# Altium project PCB_Project_cubic.PrjPcb
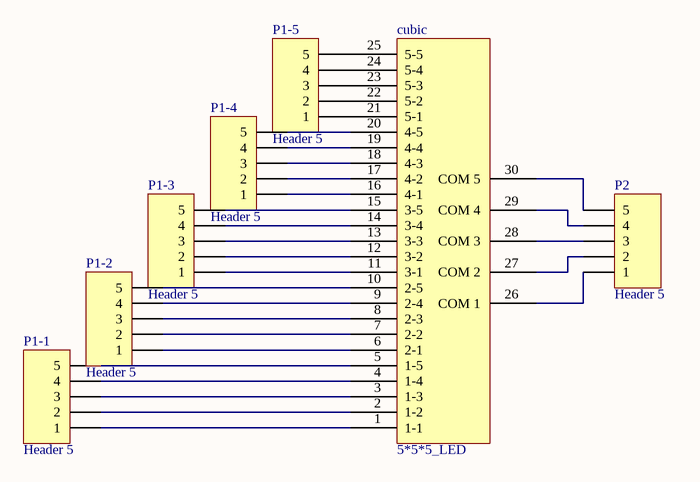
[diagram p0: BJT.SchDoc]
1 sheet, 7 parts. Net scope: global (net labels, ports and power ports of the same name join across sheets).
Board file: PCB1.PcbDoc

## Sheet BJT.SchDoc
size A4; SheetNumber: 1; SheetTotal: 1; SPICEModelCacheCIMVWHFW: <root> / <DocumentId>CIMVWHFW</DocumentId> / </root>

### Parts
cubic  5*5*5_LED  [PCBComponent_1]
P1-1  Header 5  [HDR1X5]
P1-2  Header 5  [HDR1X5]
P1-3  Header 5  [HDR1X5]
P1-4  Header 5  [HDR1X5]
P1-5  Header 5  [HDR1X5]
P2  Header 5  [HDR1X5]

### Nets
Netcubic_1: cubic.1(1-1) P1-1.1
Netcubic_2: cubic.2(1-2) P1-1.2
Netcubic_3: cubic.3(1-3) P1-1.3
Netcubic_4: cubic.4(1-4) P1-1.4
Netcubic_5: cubic.5(1-5) P1-1.5
Netcubic_6: cubic.6(2-1) P1-2.1
Netcubic_7: cubic.7(2-2) P1-2.2
Netcubic_8: cubic.8(2-3) P1-2.3
Netcubic_9: cubic.9(2-4) P1-2.4
Netcubic_10: cubic.10(2-5) P1-2.5
Netcubic_11: cubic.11(3-1) P1-3.1
Netcubic_12: cubic.12(3-2) P1-3.2
Netcubic_13: cubic.13(3-3) P1-3.3
Netcubic_14: cubic.14(3-4) P1-3.4
Netcubic_15: cubic.15(3-5) P1-3.5
Netcubic_16: cubic.16(4-1) P1-4.1
Netcubic_17: cubic.17(4-2) P1-4.2
Netcubic_18: cubic.18(4-3) P1-4.3
Netcubic_19: cubic.19(4-4) P1-4.4
Netcubic_20: cubic.20(4-5) P1-4.5
Netcubic_21: cubic.21(5-1) P1-5.1
Netcubic_22: cubic.22(5-2) P1-5.2
Netcubic_23: cubic.23(5-3) P1-5.3
Netcubic_24: cubic.24(5-4) P1-5.4
Netcubic_25: cubic.25(5-5) P1-5.5
Netcubic_26: cubic.26(COM_1) P2.1
Netcubic_27: cubic.27(COM_2) P2.2
Netcubic_28: cubic.28(COM_3) P2.3
Netcubic_29: cubic.29(COM_4) P2.4
Netcubic_30: cubic.30(COM_5) P2.5

### Library data of the parts
P1-1-P1-5 P2 = Header 5: Header, 5-Pin; LatestRevisionDate: 17-Jul-2002; LatestRevisionNote: Re-released for DXP Platform.; Publisher: Altium Limited